# Altium project Bosch.PrjPcb
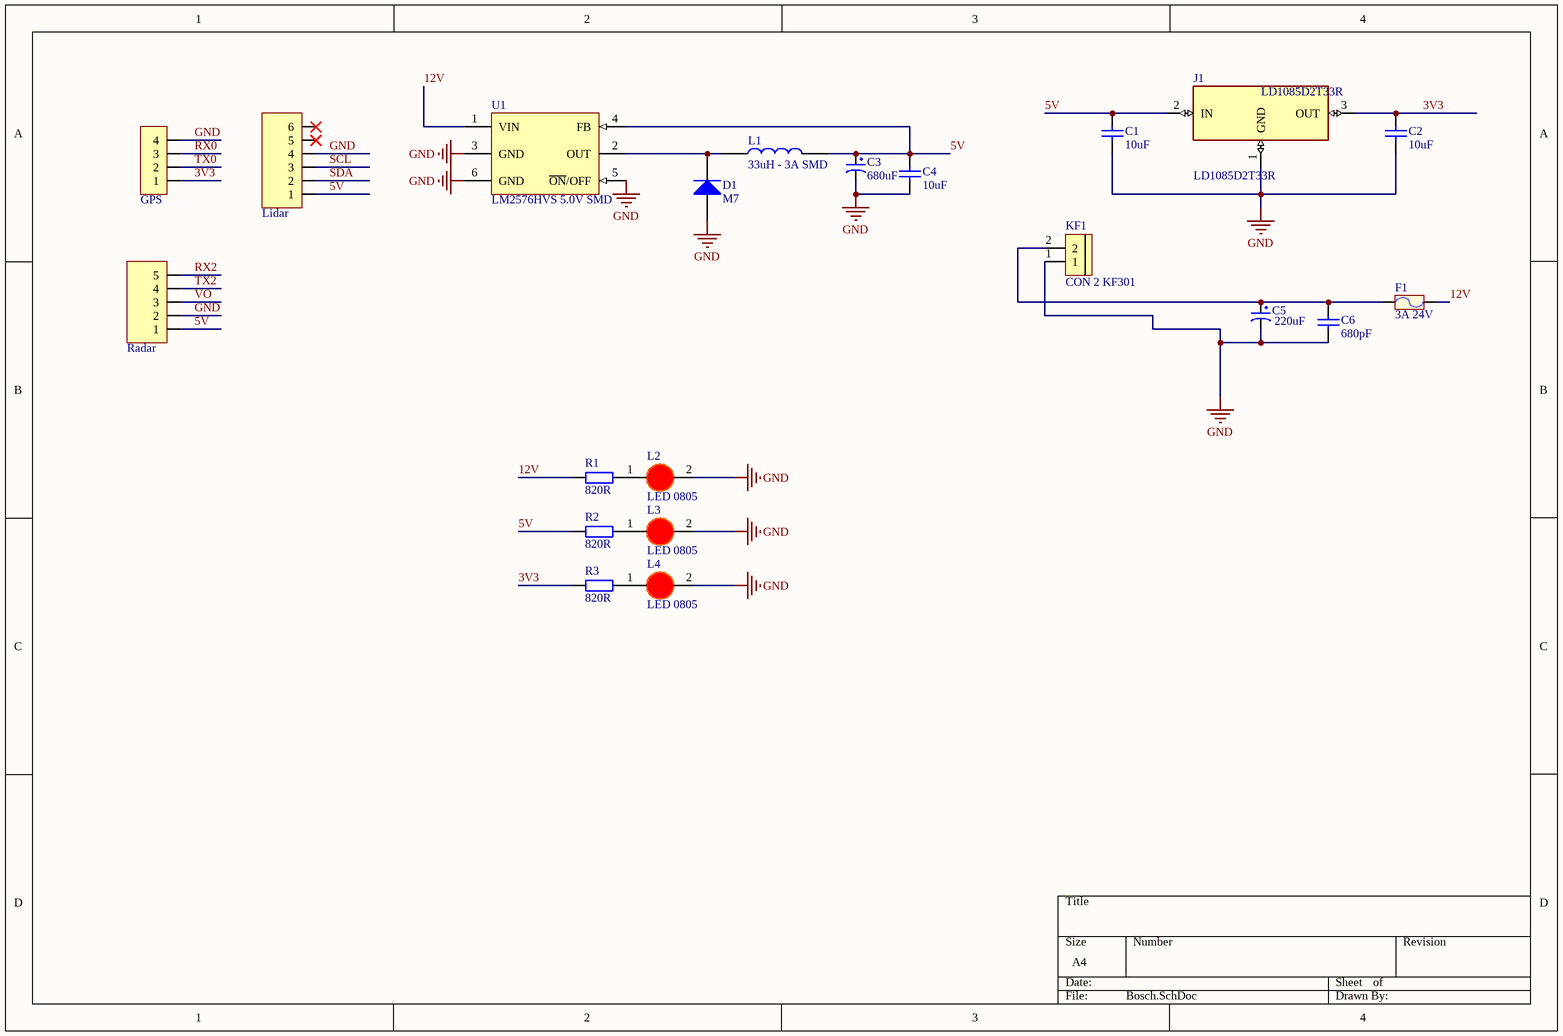
[diagram p0: Bosch.SchDoc]
2 sheets, 43 parts. Net scope: global (net labels, ports and power ports of the same name join across sheets).
Board files: Bosch.PcbDoc, PCB1.PcbDoc, PCB2.PcbDoc, PCB3.PcbDoc
Sheets:
  Bosch.SchDoc
  Bosch2.SchDoc

## Sheet Bosch.SchDoc
size A4; SheetNumber: 1; SheetTotal: 2

### Parts
C1  10uF  [tu 0805]
C2  10uF  [tu 0805]
C3  680uF  [tu hoa 10mm]
C4  10uF  [tu 0805]
C5  220uF  [tu hoa 10mm]
C6  680pF  [tu 0805]
D1  M7  [DIODE SMA]
F1  3A 24V  [Cau chi tu phuc hoi 2A 24V SMD1812]
J1  LD1085D2T33R  [LD1085D2T33R]
JP1  Radar  [JP 1x5 CT]
JP2  Lidar  [JP 1x6 CT]
JP3  GPS  [JP 1x4 CT]
KF1  CON 2 KF301  [Con 2 KF301 5.08]
L1  33uH - 3A SMD  [Cuon Cam 12x12x10]
L2  LED 0805  [LED-0805-Red]
L3  LED 0805  [LED-0805-Red]
L4  LED 0805  [LED-0805-Red]
R1  820R  [Tro SMD 0805]
R2  820R  [Tro SMD 0805]
R3  820R  [Tro SMD 0805]
U1  LM2576HVS 5.0V SMD  [TO263-5]

### Nets
3V3: C2.1 J1.3(OUT) JP3.1 R3.1
GND: C1.2 C2.2 C3.2 C4.2 C5.2 C6.2 D1.1(A) J1.1(GND) JP1.2 JP2.4 JP3.4 KF1.1 L2.2(K) L3.2(K) L4.2(K) U1.3(GND) U1.5(~{ON}/OFF) U1.6(GND)
5V: C1.1 C3.1 C4.1 J1.2(IN) JP1.1 JP2.1 L1.2 R2.1 U1.4(FB)
12V: F1.2 R1.1 U1.1(VIN)
RX0: JP3.3
RX2: JP1.5
SCL: JP2.3
SDA: JP2.2
TX0: JP3.2
TX2: JP1.4
VO: JP1.3
NetC5_1: C5.1 C6.1 F1.1 KF1.2
NetD1_2: D1.2(K) L1.1 U1.2(OUT)
NetL2_1: L2.1(A) R1.2
NetL3_1: L3.1(A) R2.2
NetL4_1: L4.1(A) R3.2

Not connected (* = marked no-connect by the designer): JP2 5* 6*

### Library data of the parts
C1 C2 C4 C6 = Tu 0805 680pF 50V 10%: Dán; Don_Vi: Con; So_Chan: 2; Ten_Linh_Kien: Tụ 0805 680pF 50V 10%; Ma_Hang: MH008098; Chung_Loai: Dán; Kieu_Chan: *
C3 C5 = Tu Hoa 470uF 35V 10x15: Cắm; Don_Vi: Con; So_Chan: 2; Ten_Linh_Kien: Tụ Hóa 470uF 35V 10x15MM; Ma_Hang: MH002204; Chung_Loai: Cắm; Kieu_Chan: *
D1 = Diode M7 ( 4007 ): Dán; Don_Vi: Con; Ten_Linh_Kien: Diode M7 1N4007 SMD 1A 1000V; Ma_Hang: MH000944; Chung_Loai: Dán; Ghi_Chu: *
F1 = Cau chi tu phuc hoi 2A 24V SMD1812: 2A 24V SMD1812; Ma_Hang: MH010033; Ten: Cầu Chì Tự Phục Hồi 2A 24V SMD1812
J1 = LD1085D2T33R: Linear Voltage Regulator IC Positive Fixed 1 Output 3A D2PAK; MF: STMicroelectronics; SnapEDA_Link: https://www.snapeda.com/parts/LD1085D2T33R/STMicroelectronics/view-part/?ref=snap; Package: D2PAK STMicroelectronics; Value: *; MP: LD1085D2T33R; Check_prices: https://www.snapeda.com/parts/LD1085D2T33R/STMicroelectronics/view-part/?ref=eda
JP1 = JP 1x5 2.54 Cai Thang: Cắm; Ten_Linh_Kien: Jump Đơn Cái 2.54MM 1x20P Thẳng; Don_Vi: Con; Ma_Hang: MH004006; Ghi_Chu: *; Kieu_Chan: *; Chung_Loai: Cắm
JP2 = JP 1x6 2.54 Cai Thang: Cắm; Ten_Linh_Kien: Jump Đơn Cái 2.54MM 1x20P Thẳng; Don_Vi: Con; Ma_Hang: MH004006; Ghi_Chu: *; Kieu_Chan: *; Chung_Loai: Cắm
JP3 = JP 1x4 2.54 Cai Thang: Cắm; Ten_Linh_Kien: Jump Đơn Cái 2.54MM 1x20P Thẳng; Don_Vi: Con; Ma_Hang: MH004006; Ghi_Chu: *; Kieu_Chan: *; Chung_Loai: Cắm
KF1 = CON 2 KF301: Cắm; Ma_Hang: MH000987; Ten_Linh_Kien: CON 2 KF301-2P 5.08MM Xanh Dương; Chung_Loai: Cắm; Ghi_Chu: *; Kieu_Chan: *; Don_Vi: Con
L1 = CUON CAM 100uH SMD: Dán; Don_Vi: Con; Ma_Hang: MH003999; Ten_Linh_Kien: Cuộn Cảm 100uH 7x7x4MM CD74; Ma_Hang: *; Kieu_Chan: *; Chung_Loai: Dán
L2-L4 = LED 0805 Do: Dán; Don_Vi: Con; Ma_Hang: MH000897; Ten_Linh_Kien: LED 0805 Màu Đỏ (Red); Ghi_Chu: *; Kieu_Chan: *; Chung_Loai: Dán
R1-R3 = Tro 0805 5% 820R: Dán; Don_Vi: Con; So_Chan: 2; Ma_Hang: MH005346; Ten_Linh_Kien: Trở 0805 5% 820R; Chung_Loai: Dán; Kieu_Chan: *
U1 = LM2576HVS 5.0V SMD: Dán; Ten_Linh_Kien: LM2576HVS-5.0V BUCK 5V 3A TO263-5; Don_Vi: Con; Ma_Hang: MH002362; Ghi_Chu: *; Kieu_Chan: *; Chung_Loai: Dán

## Sheet Bosch2.SchDoc
size A4; SheetNumber: 2; SheetTotal: 2
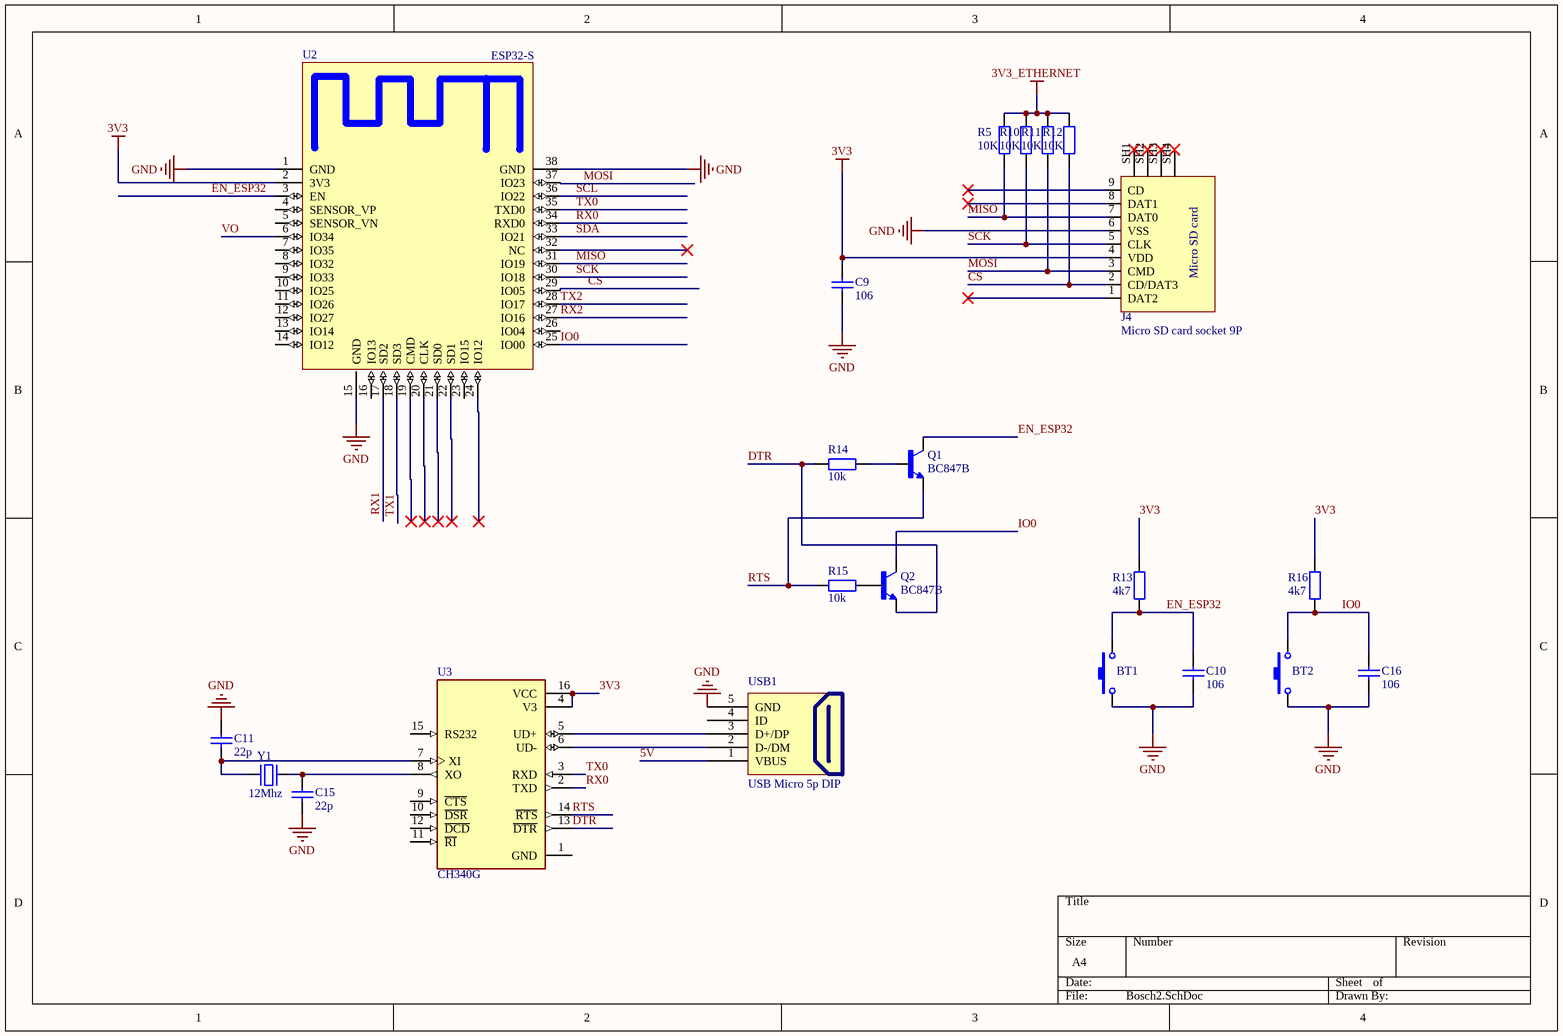
[diagram p1: Bosch2.SchDoc]

### Parts
BT1  Nut Nhan 2 Chan SMD 3x6x2.5  [Nut Nhan 2 Chan SMD 3x6x2.5]  (value not drawn)
BT2  Nut Nhan 2 Chan SMD 3x6x2.5  [Nut Nhan 2 Chan SMD 3x6x2.5]  (value not drawn)
C9  106  [tu 0805]
C10  106  [tu 0805]
C11  22p  [tu 0805]
C15  22p  [tu 0805]
C16  106  [tu 0805]
J4  Micro SD card socket 9P  [Micro SD card socket]
Q1  BC847B  [TRANS_BC847B]
Q2  BC847B  [TRANS_BC847B]
R5  10K  [Tro SMD 0805]
R10  10K  [Tro SMD 0805]
R11  10K  [Tro SMD 0805]
R12  10K  [Tro SMD 0805]
R13  4k7  [Tro SMD 0805]
R14  10k  [Tro SMD 0805]
R15  10k  [Tro SMD 0805]
R16  4k7  [Tro SMD 0805]
U2  ESP32-S  [ESP32-S]
U3  CH340G  [SOIC127P600X180-16N]
USB1  USB Micro 5p DIP  [USB Micro 5p DIP]
Y1  12Mhz  [Thach Anh 2 chan cam]

### Nets
3V3: C9.1 J4.4(VDD) R13.2 R16.2 U2.2(3V3) U3.4(V3) U3.16(VCC)
3V3_ETHERNET: R5.2 R10.2 R11.2 R12.2
GND: BT1.1 BT2.1 C9.2 C10.2 C11.1 C15.2 C16.2 J4.6(VSS) U2.1(GND) U2.15(GND) U2.38(GND) USB1.5(GND)
5V: USB1.1(VBUS)
CS: J4.2(CD/DAT3) R12.1 U2.29(IO05)
DTR: Q2.2(E) R14.2 U3.13(~{DTR})
EN_ESP32: BT1.2 C10.1 Q1.3(C) R13.1 U2.3(EN)
IO0: BT2.2 C16.1 Q2.3(C) R16.1 U2.25(IO00)
MISO: J4.7(DAT0) R5.1 U2.31(IO19)
MOSI: J4.3(CMD) R11.1 U2.37(IO23)
RTS: Q1.2(E) R15.2 U3.14(~{RTS})
RX0: U2.34(RXD0) U3.2(TXD)
RX1: U2.17(SD2)
RX2: U2.27(IO16)
SCK: J4.5(CLK) R10.1 U2.30(IO18)
SCL: U2.36(IO22)
SDA: U2.33(IO21)
TX0: U2.35(TXD0) U3.3(RXD)
TX1: U2.18(SD3)
TX2: U2.28(IO17)
VO: U2.6(IO34)
NetC11_2: C11.2 U3.7(XI) Y1.1
NetC15_1: C15.1 U3.8(XO) Y1.2
NetQ1_1: Q1.1(B) R14.1
NetQ2_1: Q2.1(B) R15.1
NetU3_5: U3.5(UD+) USB1.3(D+/DP)
NetU3_6: U3.6(UD-) USB1.2(D-/DM)

Not connected (* = marked no-connect by the designer): J4 1(DAT2)* 8(DAT1)* 9(CD)* SH1(SHIELD)* SH2(SHIELD)* SH3(SHIELD)* SH4(SHIELD)*; U2 4(SENSOR_VP) 5(SENSOR_VN) 7(IO35) 8(IO32) 9(IO33) 10(IO25) 11(IO26) 12(IO27) 13(IO14) 14(IO12) 16(IO13) 19(CMD)* 20(CLK)* 21(SD0)* 22(SD1)* 23(IO15) 24(IO12)* 26(IO04) 32(NC)*; U3 1(GND) 9(~{CTS}) 10(~{DSR}) 11(~{RI}) 12(~{DCD}) 15(RS232); USB1 4(ID)

### Notes on the sheet
- (in symbol Micro SD card socket 9P) Micro SD card

### Library data of the parts
BT1 BT2 = Nut Nhan 2 Chan SMD 3x6x2.5: Ma_Hang: MH001036; Ten: Nút Nhấn 2 Chân 3x6x2.5MM SMD
C9-C11 C15 C16 = Tu 0805 680pF 50V 10%: as C1 on sheet Bosch; Chung_Loai: Dán; Kieu_Chan: *
J4 = Micro SD card socket 9P: 9 (8 + 1) Position Card Connector microSD Surface Mount, Right Angle Gold; MF: Global Connector Technology; MP: MEM2075-00-140-01-A; Price: None; SnapEDA_Link: https://www.snapeda.com/parts/MEM2075-00-140-01-A/Global%20Connector%20Technology/view-part/2680480/?ref=snap; Value: *; Availability: In Stock; Package: Package; Check_prices: https://www.snapeda.com/parts/MEM2075-00-140-01-A/Global%20Connector%20Technology/view-part/2680480/?ref=eda
Q1 Q2 = BC847B: BJT, SOT-23, 45V, 100mA, NPN, 0.25W, 150C; MF: Diotec Semiconductor; SnapEDA_Link: https://www.snapeda.com/parts/BC847B/Diotec/view-part/?ref=snap; Package: SOT-23-3 Diotec; Value: *; MP: BC847B; Check_prices: https://www.snapeda.com/parts/BC847B/Diotec/view-part/?ref=eda
R5 R10-R16 = Tro 0805 5% 820R: as R1 on sheet Bosch; Chung_Loai: Dán; Kieu_Chan: *
U3 = CH340G: USB Interface Integrated Circuit; MF: WCH; Value: *; SnapEDA_Link: https://www.snapeda.com/parts/Ch340G/WCH/view-part/?ref=snap; MP: Ch340G; Check_prices: https://www.snapeda.com/parts/Ch340G/WCH/view-part/?ref=eda; Availability: Not in stock; Price: None; Package: None
USB1 = USB Micro 5p DIP: USB Type B; Ten: MicroUSB MK5P DIP; Ma_Hang: MH005145
Y1 = Thach Anh 2 chan Cam: Crystal For all Crystal 2pin.; Value: 4Mhz

## Nets that join several sheets
3V3: Bosch (C2.1 J1.3 JP3.1 R3.1), Bosch2 (7 pins)
GND: Bosch (18 pins), Bosch2 (12 pins)
5V: Bosch (9 pins), Bosch2 (USB1.1)
RX0: Bosch (JP3.3), Bosch2 (U2.34 U3.2)
RX2: Bosch (JP1.5), Bosch2 (U2.27)
SCL: Bosch (JP2.3), Bosch2 (U2.36)
SDA: Bosch (JP2.2), Bosch2 (U2.33)
TX0: Bosch (JP3.2), Bosch2 (U2.35 U3.3)
TX2: Bosch (JP1.4), Bosch2 (U2.28)
VO: Bosch (JP1.3), Bosch2 (U2.6)